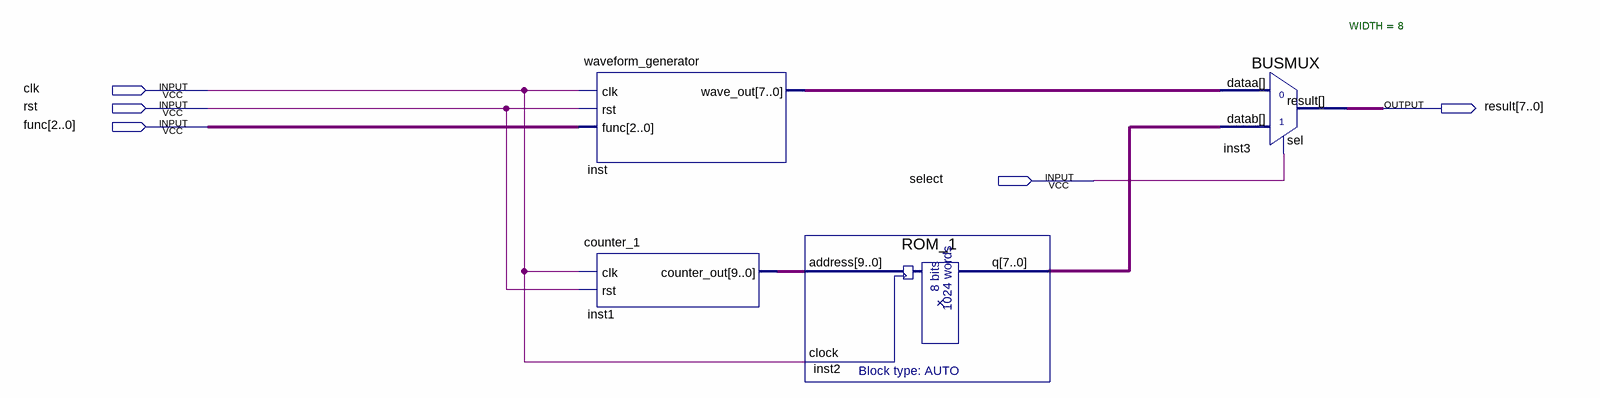
[diagram p0: schematic sheet]
// Quartus schematic WaveformGenerator.bdf as structural Verilog: 4 symbols, 5 pins
module WaveformGenerator (
  input  clk,
  input  rst,
  input  [2:0] func,
  input  select,
  output [7:0] result
);

  wire [7:0] inst2_q, inst_wave_out;
  wire [9:0] inst1_counter_out;

  waveform_generator inst (.clk(clk), .rst(rst), .func(func), .wave_out(inst_wave_out));
  counter_1 inst1 (.clk(clk), .rst(rst), .counter_out(inst1_counter_out));
  ROM_1 inst2 (.address(inst1_counter_out), .clock(clk), .q(inst2_q));
  BUSMUX #(.WIDTH(8)) inst3 (.datab(inst2_q), .sel(select), .dataa(inst_wave_out), .result(result));
endmodule
